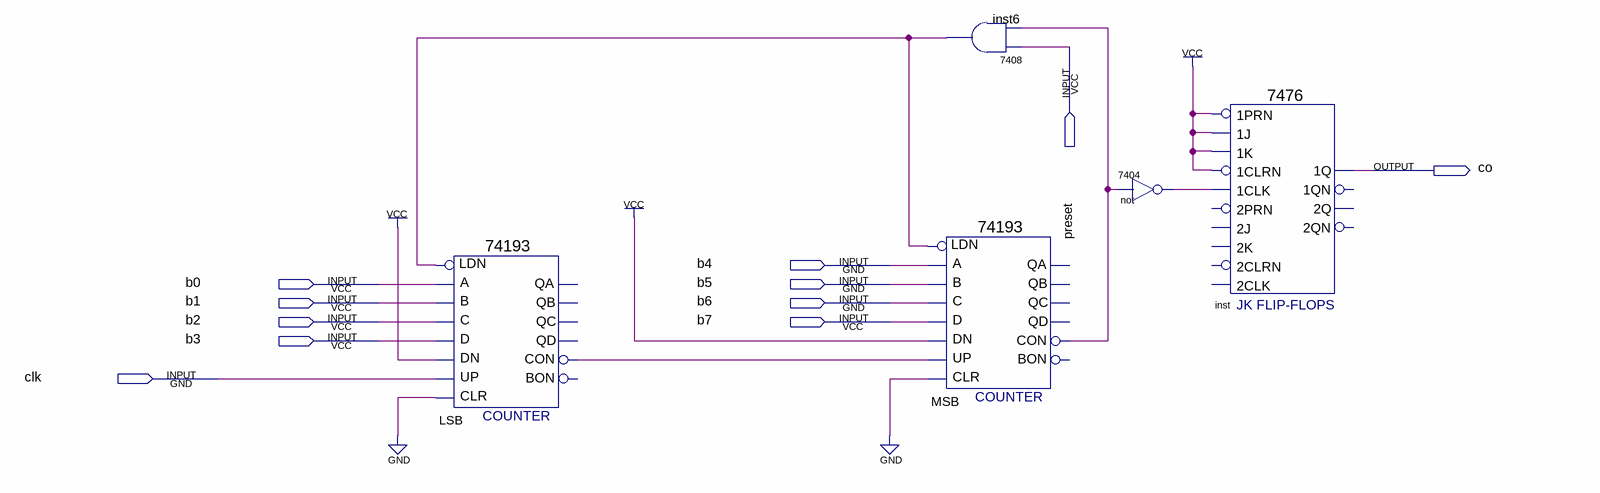
[diagram p0: schematic sheet]
// Quartus schematic Counter.bdf as structural Verilog: 5 symbols, 11 pins
module Counter (
  input  preset,
  input  b4,
  input  b0,
  input  b5,
  input  b1,
  input  b6,
  input  b2,
  input  b7,
  input  b3,
  input  clk,
  output co
);

  wire inst6_1, LSB_con, MSB_con, not_1;

  \74193  LSB (
    .D(b3), .C(b2), .B(b1), .A(b0), .CLR(1'b0), .UP(clk), .DN(1'b1), .LDN(inst6_1), .CON(LSB_con));  // open: QB, QA, QD, QC, BON
  \74193  MSB (
    .D(b7), .C(b6), .B(b5), .A(b4), .CLR(1'b0), .UP(LSB_con), .DN(1'b1), .LDN(inst6_1), .CON(MSB_con));  // open: QB, QA, QD, QC, BON
  \7408  inst6 (.\3 (MSB_con), .\2 (preset), .\1 (inst6_1));
  \7404  \not  (.\2 (MSB_con), .\1 (not_1));
  \7476  inst (
    .\1J (1'b1), .\1K (1'b1), .\1PRN (1'b1), .\1CLK (not_1), .\1CLRN (1'b1), .\1Q (co));  // open: 2PRN, 2J, 2K, 2CLRN, 2CLK, 2QN, 2Q, 1QN
endmodule
